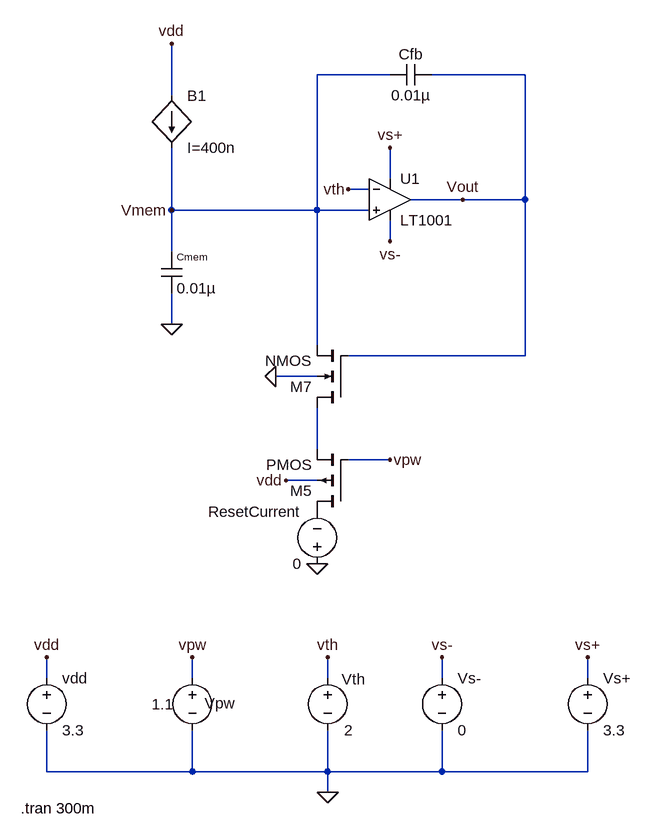
[diagram p0: schematic mm13_q4_subQ2_working.asc]
mm13_q4_subQ2_working.asc, the LTspice schematic file:
Version 4.1
SHEET 1 2520 968
WIRE 1488 -176 1376 -176
WIRE 1696 -176 1552 -176
WIRE 1152 -144 1152 -224
WIRE 1488 -16 1488 -64
WIRE 1456 0 1424 0
WIRE 1600 16 1520 16
WIRE 1696 16 1696 -176
WIRE 1696 16 1600 16
WIRE 1152 32 1152 -64
WIRE 1376 32 1376 -176
WIRE 1376 32 1152 32
WIRE 1456 32 1376 32
WIRE 1488 80 1488 48
WIRE 1152 96 1152 32
WIRE 1152 208 1152 160
WIRE 1376 240 1376 32
WIRE 1696 256 1696 16
WIRE 1696 256 1424 256
WIRE 1376 288 1312 288
WIRE 1376 400 1376 336
WIRE 1488 416 1424 416
WIRE 1376 448 1328 448
WIRE 960 752 960 720
WIRE 1184 752 1184 720
WIRE 1392 752 1392 720
WIRE 1568 752 1568 720
WIRE 1792 752 1792 720
WIRE 960 896 960 832
WIRE 1184 896 1184 832
WIRE 1184 896 960 896
WIRE 1392 896 1392 832
WIRE 1392 896 1184 896
WIRE 1568 896 1568 832
WIRE 1568 896 1392 896
WIRE 1792 896 1792 832
WIRE 1792 896 1568 896
WIRE 1392 928 1392 896
FLAG 1152 208 0
FLAG 1152 -224 vdd
FLAG 960 720 vdd
FLAG 1328 448 vdd
FLAG 1312 288 0
FLAG 1184 720 vpw
FLAG 1392 720 vth
FLAG 1568 720 vs-
FLAG 1792 720 vs+
FLAG 1424 0 vth
FLAG 1488 80 vs-
FLAG 1488 -64 vs+
FLAG 1392 928 0
FLAG 1488 416 vpw
FLAG 1376 576 0
FLAG 1152 32 Vmem
FLAG 1600 16 Vout
SYMBOL voltage 1792 736 R0
SYMATTR InstName Vs+
SYMATTR Value 3.3
SYMBOL voltage 1568 736 R0
SYMATTR InstName Vs-
SYMATTR Value 0
SYMBOL voltage 1392 736 R0
WINDOW 0 40 2 Top 2
WINDOW 3 32 81 Top 2
WINDOW 123 0 0 Left 0
WINDOW 39 0 0 Left 0
SYMATTR InstName Vth
SYMATTR Value 2
SYMBOL cap 1136 96 R0
WINDOW 0 24 8 Left 1
SYMATTR InstName Cmem
SYMATTR Value 0.01µ
SYMBOL voltage 1184 736 R0
WINDOW 0 19 55 Left 2
WINDOW 3 -46 41 Top 2
WINDOW 123 0 0 Left 0
WINDOW 39 0 0 Left 0
SYMATTR InstName Vpw
SYMATTR Value 1.1
SYMBOL nmos4 1424 336 R180
SYMATTR InstName M7
SYMBOL pmos4 1424 496 R180
SYMATTR InstName M5
SYMBOL bi 1152 -144 R0
SYMATTR InstName B1
SYMATTR Value I=400n
SYMBOL voltage 960 736 R0
SYMATTR InstName vdd
SYMATTR Value 3.3
SYMBOL LT1001 1488 -48 R0
SYMATTR InstName U1
SYMBOL cap 1488 -160 R270
WINDOW 0 32 32 VTop 2
WINDOW 3 0 32 VBottom 2
SYMATTR InstName Cfb
SYMATTR Value 0.01µ
SYMBOL voltage 1376 592 R180
WINDOW 0 24 96 Left 2
WINDOW 3 24 16 Left 2
SYMATTR InstName ResetCurrent
SYMATTR Value 0
TEXT 920 952 Left 2 !.tran 300m

The netlist it stands for:
* mm13_q4_subQ2_working.asc
Vs+ vs+ 0 3.3
Vs- vs- 0 0
Vth vth 0 2
Cmem Vmem 0 0.01µ
Vpw vpw 0 1.1
M7 N001 Vout Vmem 0 NMOS
M5 P001 vpw N001 vdd PMOS
B1 vdd Vmem I=400n
vdd vdd 0 3.3
X§U1 Vmem vth vs+ vs- Vout LT1001  ; pins In+ In- V+ V- OUT
Cfb Vmem Vout 0.01µ
V§ResetCurrent 0 P001 0
.model NMOS NMOS
.model PMOS PMOS
.lib standard.mos
.tran 300m
.lib LTC.lib
.backanno
.end